# Altium schematic sheet Sheet1.SchDoc
size A4; SheetNumber: 1; SheetTotal: 1
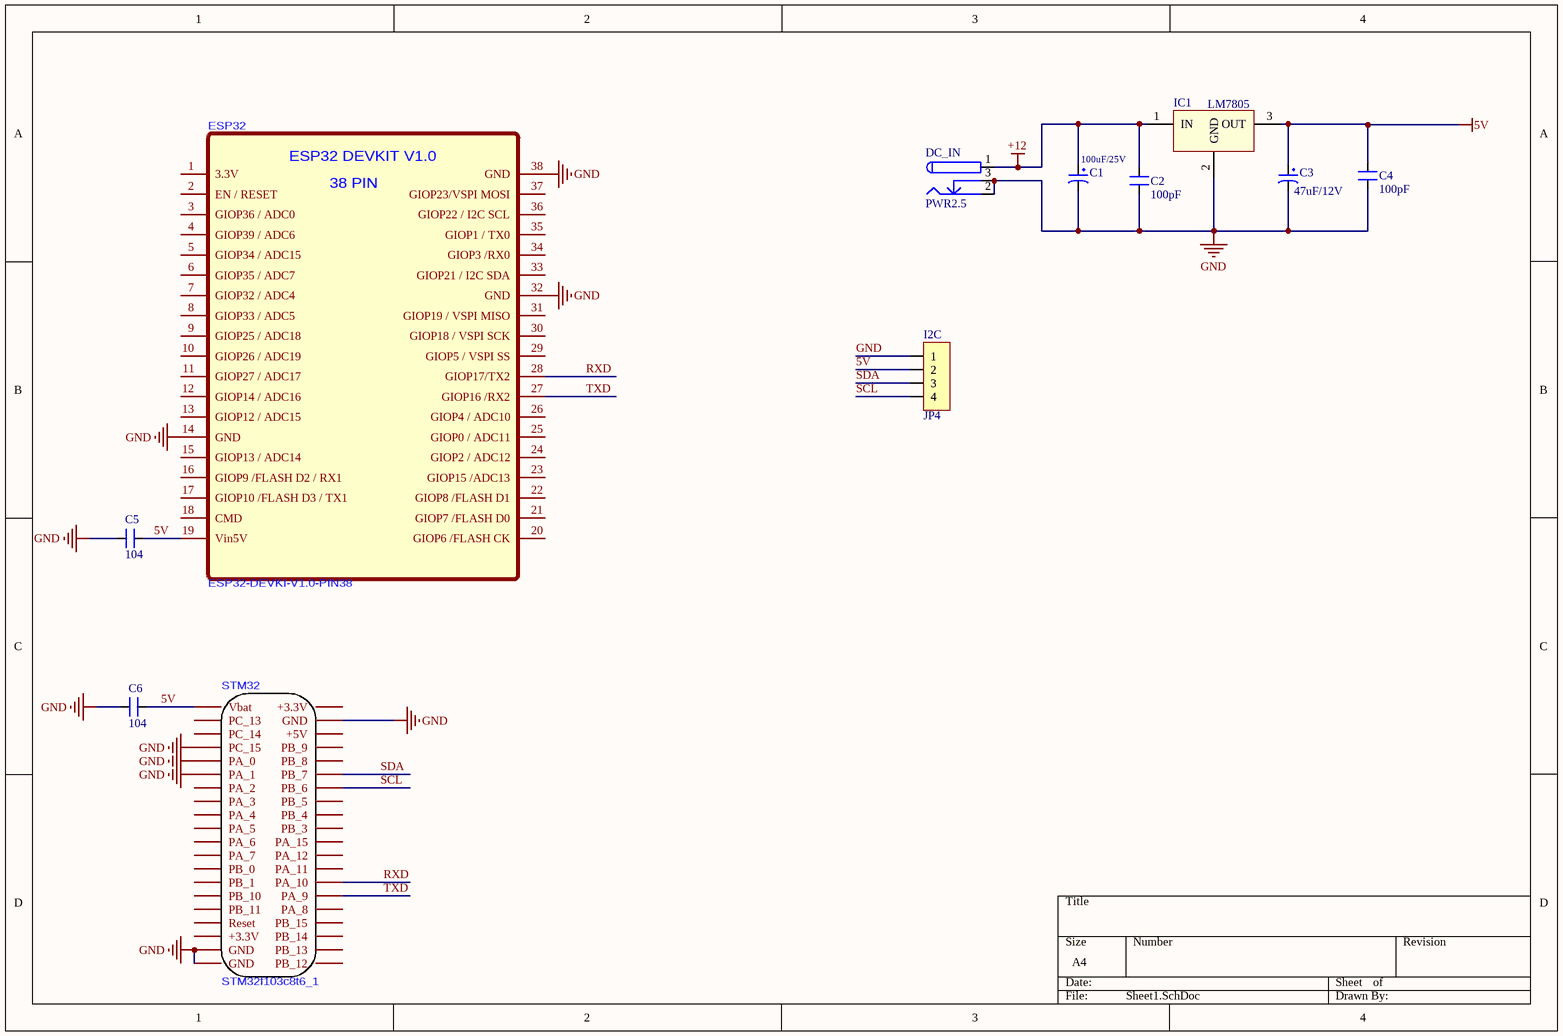
[diagram p0: Sheet1.SchDoc]

## Parts
C1  100uF/25V  [CP1.5/3.4]
C2  100pF  [CN1]
C3  47uF/12V  [CP1.5/3.4]
C4  100pF  [CN1]
C5  104  [CN1]
C6  104  [CN1]
DC_IN  PWR2.5  [PW-J-2MM]
ESP32  ESP32-DEVKI-V1.0-PIN38  [ESP32-DEVKIT-V1.0-38PIN-PCB - duplicate]
I2C  JP4  [JP4-C1T]
IC1  LM7805  [QTO-220]
STM32  STM32f103c8t6_1  [STM32F103C8T6]

## Nets
5V: C3.1 C4.2 C5.2 C6.2 ESP32.19(Vin5V) I2C.2 IC1.3(OUT) STM32.1(Vbat)
+12: C1.1 C2.2 DC_IN.1 IC1.1(IN)
GND: C1.2 C2.1 C3.2 C4.1 C5.1 C6.1 DC_IN.2 DC_IN.3 ESP32.14(GND) ESP32.32(GND) ESP32.38(GND) I2C.1 IC1.2(GND) STM32.4(PC_15) STM32.5(PA_0) STM32.6(PA_1) STM32.19(GND) STM32.20(GND) STM32.39(GND)
RXD: ESP32.28(GIOP17/TX2) STM32.27(PA_10)
SCL: I2C.4 STM32.34(PB_6)
SDA: I2C.3 STM32.35(PB_7)
TXD: ESP32.27(GIOP16_/RX2) STM32.26(PA_9)

Not connected (* = marked no-connect by the designer): ESP32 1(3.3V) 2(EN_/_RESET) 3(GIOP36_/_ADC0) 4(GIOP39_/_ADC6) 5(GIOP34_/_ADC15) 6(GIOP35_/_ADC7) 7(GIOP32_/_ADC4) 8(GIOP33_/_ADC5) 9(GIOP25_/_ADC18) 10(GIOP26_/_ADC19) 11(GIOP27_/_ADC17) 12(GIOP14_/_ADC16) 13(GIOP12_/_ADC15) 15(GIOP13_/_ADC14) 16(GIOP9_/FLASH_D2_/_RX1) 17(GIOP10_/FLASH_D3_/_TX1) 18(CMD) 20(GIOP6_/FLASH_CK) 21(GIOP7_/FLASH_D0) 22(GIOP8_/FLASH_D1) 23(GIOP15_/ADC13) 24(GIOP2_/_ADC12) 25(GIOP0_/_ADC11) 26(GIOP4_/_ADC10) 29(GIOP5_/_VSPI_SS) 30(GIOP18_/_VSPI_SCK) 31(GIOP19_/_VSPI_MISO) 33(GIOP21_/_I2C_SDA) 34(GIOP3_/RX0) 35(GIOP1_/_TX0) 36(GIOP22_/_I2C_SCL) 37(GIOP23/VSPI_MOSI); STM32 2(PC_13) 3(PC_14) 7(PA_2) 8(PA_3) 9(PA_4) 10(PA_5) 11(PA_6) 12(PA_7) 13(PB_0) 14(PB_1) 15(PB_10) 16(PB_11) 17(Reset) 18(+3.3V) 21(PB_12) 22(PB_13) 23(PB_14) 24(PB_15) 25(PA_8) 28(PA_11) 29(PA_12) 30(PA_15) 31(PB_3) 32(PB_4) 33(PB_5) 36(PB_8) 37(PB_9) 38(+5V) 40(+3.3V)

## Notes on the sheet
- (in symbol ESP32-DEVKI-V1.0-PIN38) ESP32 DEVKIT V1.0; 38 PIN

## Library data of the parts
C1 C3 = CP3: Cap 100uF/35V - 470uF/16V; Value: 100uF/35V/50V; Description 1: 1000uF/6,3V - 470uF/16V - 330uF - 25V; Description 2: 220uF/35V - 100uF/50V - 63V - 4,7uF/200V; Description 3: 22uF => 33uF100V - 3,3uF => 4,7uF/250V; Description 4: 2,2uF =>3,3uF/350 - 2,2uF/400V - 1uF/450V
C2 C4 = CN1: Cap np  1pF - 472pF; Value: 100pF
C5 C6 = CAP-DIP: Cremic For Xtal 1pF => 100pF; Value: 33pF
DC_IN = PWR2.5: Low Voltage Power Supply Connector; Published: 17-Dec-2003; DatasheetDocument: 09-May-2002; Publisher: Altium Limited; ComponentLink1Description: Manufacturer Link; ComponentLink1URL: http://domino.kycon.com/internet/Products.html
I2C = JP4: WR-PHD 2.54 mm Angled Socket Header; Manufacturer: W¨¹rth Elektronik eiSos GmbH; partNo: 613004143121; ComponentLink1 Description: Manufacturer; ComponentLink2 Description: Datasheet; NoPins: 04; Created Date: 29 March 2013; ComponentLink1URL: http://www.we-online.com; ComponentLink2URL: http://katalog.we-online.de/em/datasheet/6130xx143121.pdf; Created by: Karrer Zheng
IC1 = LM78xx: On ap +, from + 5 to + 24VDC; Value: LM7805